# EAGLE design ATX Regulated Power Supply (EAGLE 5.11)
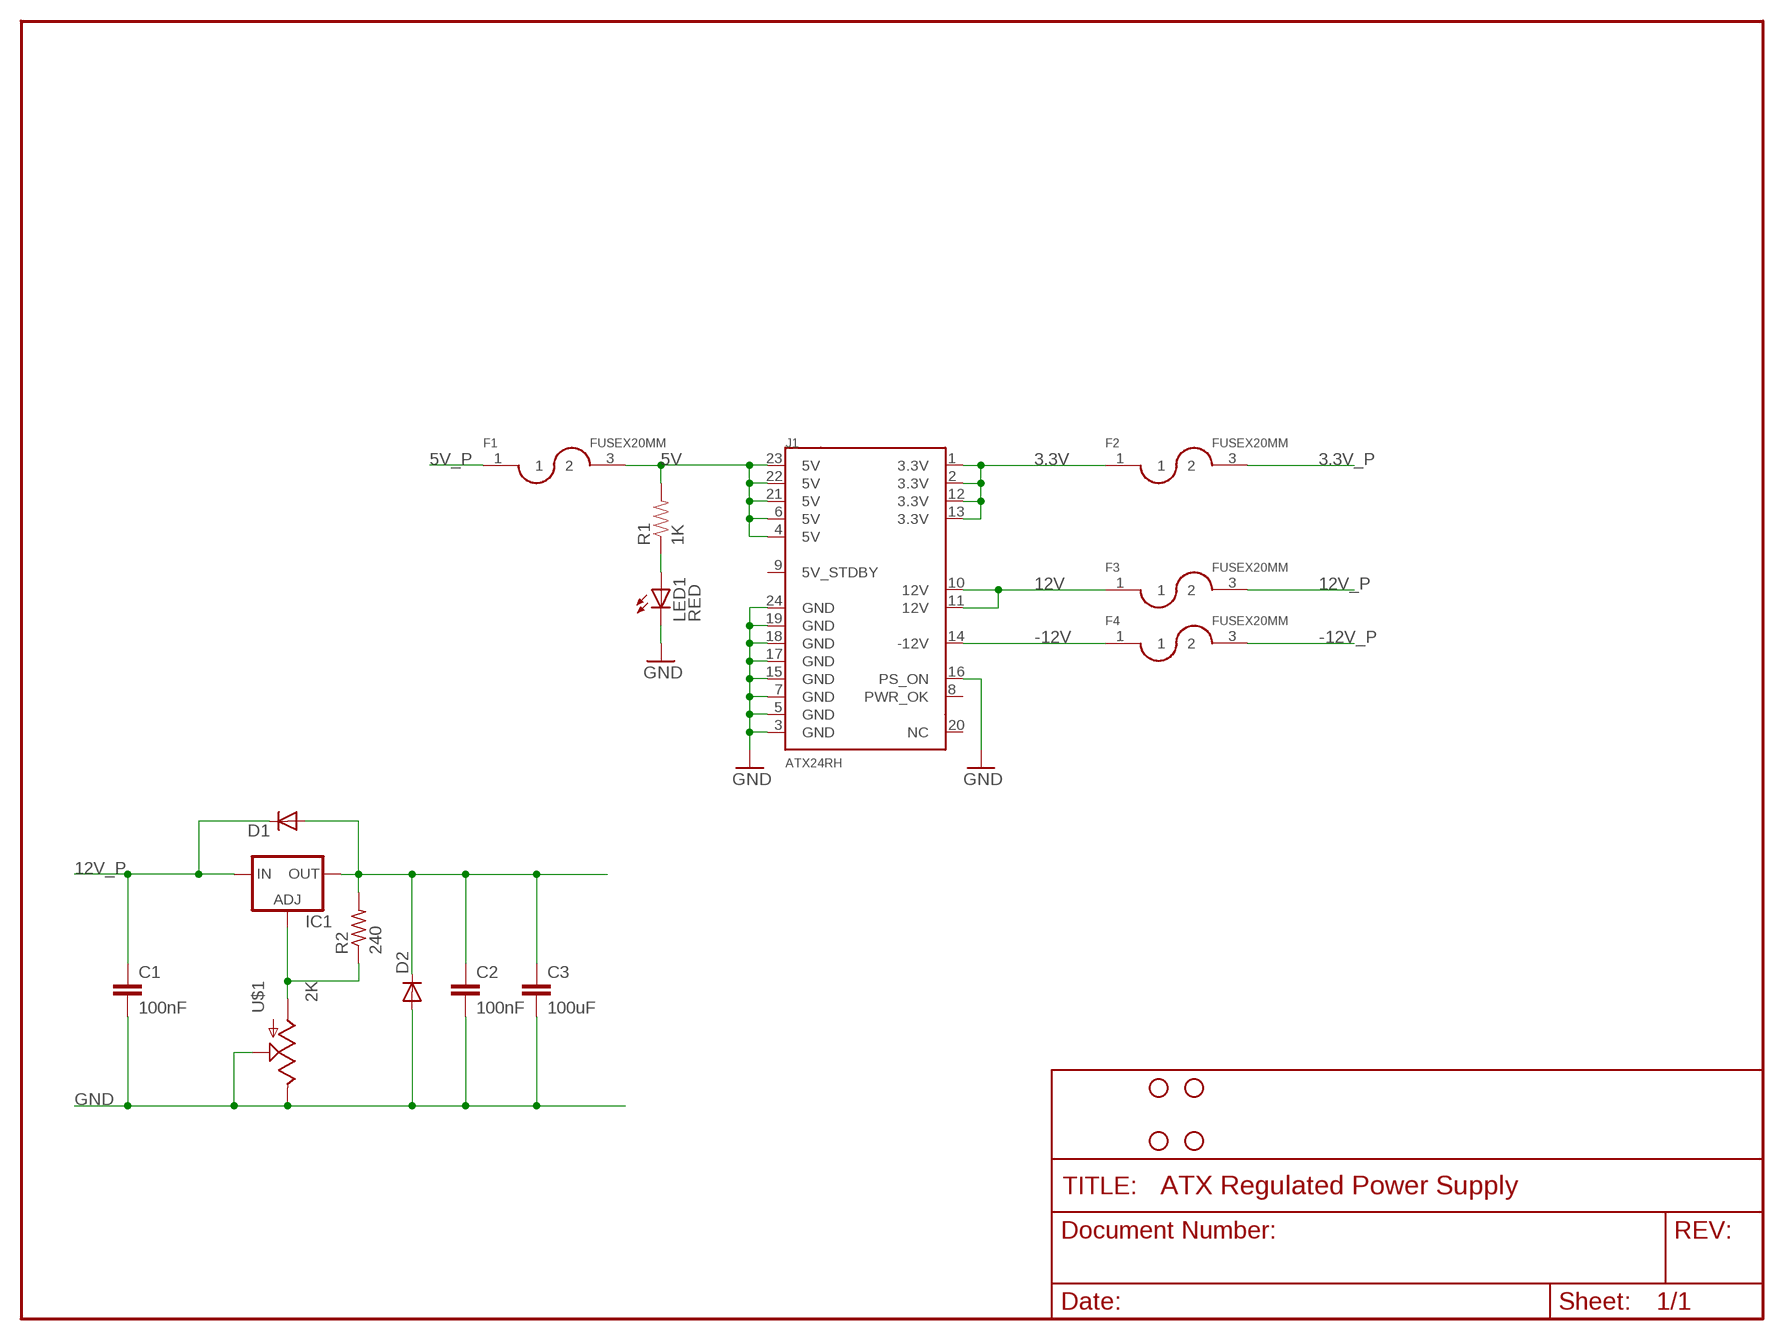
[diagram p0: schematic, sheet 1]

## Parts
C1  100nF  C-EU025-024X044  [C025-024X044]
C2  100nF  C-EU025-024X044  [C025-024X044]
C3  100uF  C-EU025-024X044  [C025-024X044]
D1  DIODE1N4148  [DIODE-1N4148]
D2  DIODE1N4148  [DIODE-1N4148]
F1  FUSEX20MM  [FUSE_5MM]
F2  FUSEX20MM  [FUSE_5MM]
F3  FUSEX20MM  [FUSE_5MM]
F4  FUSEX20MM  [FUSE_5MM]
IC1  LM317TS  [317TS]
J1  ATX24RH  [ATX24_RIGHT_ANGLE]
JP2  STAND-OFF  [STAND-OFF]
JP3  STAND-OFF  [STAND-OFF]
JP4  STAND-OFF  [STAND-OFF]
JP5  STAND-OFF  [STAND-OFF]
LED1  RED  LED5MM  [LED5MM]
R1  1K  RESISTORPTH1  [AXIAL-0.3]
R2  240  R-US_0204/2V  [0204V]
U$1  2K  POT-RV16AF-20  [POT_ALPHA_RV16AF-20]

## Nets
3.3V: F2.1 J1.1(3.3V) J1.2(3.3V) J1.12(3.3V) J1.13(3.3V)
3.3V_P: F2.3
5V: F1.3 J1.4(5V) J1.6(5V) J1.21(5V) J1.22(5V) J1.23(5V) R1.P$2
5V_P: F1.1
12V: F3.1 J1.10(12V) J1.11(12V)
12V_P: C1.1 D1.C F3.3 IC1.3(IN)
-12V: F4.1 J1.14(-12V)
-12V_P: F4.3
GND: C1.2 C2.2 C3.2 D2.A J1.3(GND) J1.5(GND) J1.7(GND) J1.15(GND) J1.16(PS_ON) J1.17(GND) J1.18(GND) J1.19(GND) J1.24(GND) LED1.K(C) U$1.2(S) U$1.3(E)
N$1: LED1.A R1.P$1
N$4: IC1.1(ADJ) R2.1 U$1.1(A)
VOUT: C2.1 C3.1 D1.A D2.C IC1.2(OUT) R2.2
Unconnected: J1.8(PWR_OK) J1.9(5V_STDBY) J1.20(NC)

## Library data of the parts
C1-C3 = resistor:C-EU: CAPACITOR, European symbol
D1 D2 = SparkFun:DIODE: Diode These are standard reverse protection diodes and small signal diodes. SMA package can handle up to about 1A. SOD-323 can handle about 200mA. What the SOD-323 package when ordering, there are some mfgs out there that are 5-pin packages.
F1-F4 = SparkFun:FUSE
IC1 = v-reg:LM317TS: VOLTAGE REGULATOR
J1 = SparkFun:ATX24
JP2-JP5 = SparkFun:STAND-OFF: Stand Off This is the mechanical footprint for a #4 phillips button head screw. Use the keepout ring to avoid running the screw head into surrounding components. SKU : PRT-00447
LED1 = SparkFun:LED: LEDs Standard schematic elements and footprints for 5mm, 3mm, 1206, and 0603 sized LEDs. 5mm - Spark Fun Electronics SKU : COM-00529 (and others)
R1 = SparkFun:RESISTOR: Resistor Basic schematic elements and footprints for 0603, 1206, and PTH 1/10th watt (small) resistors.
R2 = resistor:R-US_: RESISTOR, American symbol
U$1 = SparkFun:POT

## Board
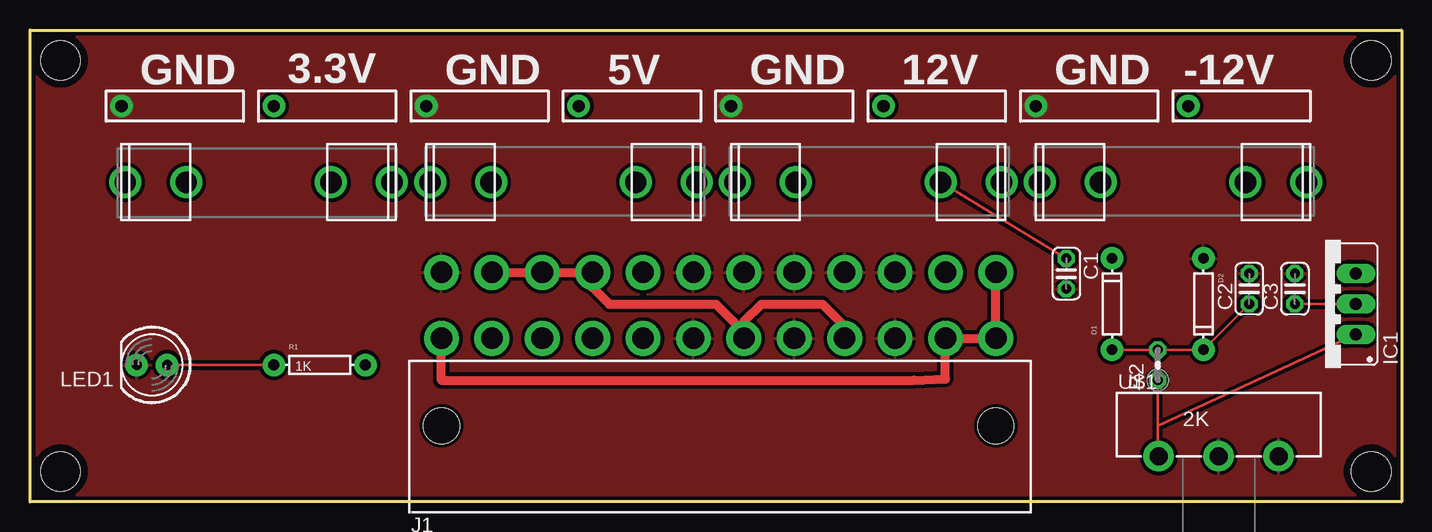
[diagram p1: board, top side]
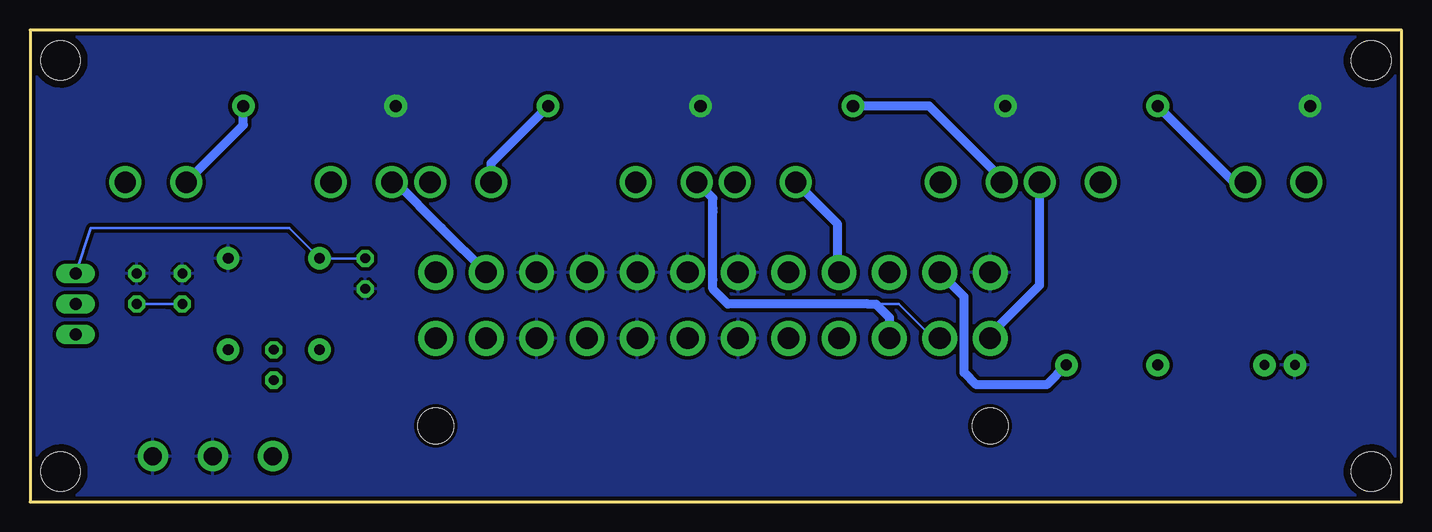
[diagram p2: board, bottom side, seen from below]

Size 114.3 x 39.37 mm. Coordinates in mm from the lower left corner, seen from the top.
Outline: 0,0 0,39.37 114.3,39.37 114.3,0 0,0
Copper layers (1*16): Top 0.035mm / dielectric 1.5mm / Bottom 0.035mm
Design rules "SparkFun": minimum track width 8mil, minimum drill 20mil, track to track 8mil, track to pad 8mil, pad to pad 8mil, via to via 8mil, smd to smd 8mil, copper to edge 8mil, drill to drill 8mil, minimum pad ring 12mil, minimum via ring 10mil, stop-mask expansion 4mil, vias tented up to drill 20mil, thermal gap 10mil

### Footprints (pad centres in the part's own frame; a part is rotated, then mirrored left to right if it is on the bottom)
C025-024X044 = drill 0.813 octagon: 1 -1.27,0; 2 1.27,0
DIODE-1N4148 = drill 0.9 pad 1.88 round: A -3.81,0; C 3.81,0
FUSE_5MM = drill 1.778 round: 1 0,-11.113; 2 0,-6.032; 3 0,6.032; 4 0,11.113
317TS = drill 1.016 long: 1 -2.54,-2.54; 2 0,-2.54; 3 2.54,-2.54
ATX24_RIGHT_ANGLE = drill 1.8 pad 2.9 round: 1 23.34,4.76; 2 19.14,4.76; 3 14.94,4.76; 4 10.74,4.76; 5 6.54,4.76; 6 2.34,4.76; 7 -1.86,4.76; 8 -6.06,4.76; 9 -10.26,4.76; 10 -14.46,4.76; 11 -18.66,4.76; 12 -22.86,4.76; 13 23.34,10.26; 14 19.14,10.26; 15 14.94,10.26; 16 10.74,10.26; 17 6.54,10.26; 18 2.34,10.26; 19 -1.86,10.26; 20 -6.06,10.26; 21 -10.26,10.26; 22 -14.46,10.26; 23 -18.66,10.26; 24 -22.86,10.26 | hole 3: -22.86,-2.54; 23.34,-2.54
STAND-OFF = hole 3.302: 0,0
LED5MM = drill 0.813 pad 1.88 round: A -1.27,0; K 1.27,0
AXIAL-0.3 = drill 0.9 pad 1.88 round: P$1 -3.81,0; P$2 3.81,0
0204V = drill 0.813 octagon: 1 -1.27,0; 2 1.27,0
POT_ALPHA_RV16AF-20 = drill 1.5 pad 2.54 round: 1 -5,0; 2 0,0; 3 5,0

### Placement (x,y rotation side)
C1  86.36,19.05 270 top
C2  101.6,17.78 90 top
C3  105.41,17.78 90 top
D1  90.17,16.51 90 top
D2  97.79,16.51 270 top
F1  44.45,26.67 270 top
F2  19.05,26.67 90 top
F3  69.85,26.67 270 top
F4  95.25,26.67 270 top
IC1  107.95,16.51 90 top
J1  57.15,8.89 0 top
JP2  111.76,2.54 0 top
JP3  111.76,36.83 0 top
JP4  2.54,2.54 0 top
JP5  2.54,36.83 0 top
LED1  10.16,11.43 180 top
R1  24.13,11.43 0 top
R2  93.98,11.43 90 top
U$1  99.06,3.81 0 top

### Tracks (layer width: path | path; a pad name or v marks a point on that pad's centre or on a via)
3.3V
  Top 0.762: 80.52,13.59 80.49,13.62 | 80.49,13.62 J1.1 | 80.49,13.62 J1.1 | J1.1 J1.13 | 80.52,13.59 80.49,13.62 | 80.52,13.59 80.49,13.62 | 80.49,13.62 J1.1 | 80.52,13.59 80.46,13.65 J1.2 76.29,10.25 73.66,10.16 34.29,10.16 J1.12
  Bottom 0.762: J1.12 34.29,13.97 30.16,18.1 F2.1
3.3V_P  (via drill 1.02 pad 1.88)
  Bottom 0.762: F2.3 13.97,26.67 v20.32,33.02
5V
  Top 0.762: 42.77,19.15 42.8,19.18 42.77,19.15 | J1.22 42.77,19.15 | J1.23 J1.22 | J1.22 42.77,19.15 | J1.22 43.03,19.15 43.05,19.18 43.08,19.15 J1.21 46.89,17.88 48.26,16.51 57.15,16.51 58.42,15.24 59.49,14.17 J1.6 59.49,15.04 60.96,16.51 66.04,16.51 67.89,14.66 J1.4
  Bottom 0.762: J1.23 36.45,17.11 36.45,13.08 36.45,10.79 35.43,9.78 29.59,9.78 R1.P$2 | J1.21 46.99,19.05 46.99,23.18 F1.3
5V_P  (via drill 1.02 pad 1.88)
  Bottom 0.762: v45.72,33.02 39.37,33.02 33.34,26.99 F1.1
12V
  Top 0.762: 42.73,13.65 42.8,13.72 42.73,13.65 | J1.10 42.73,13.65
  Bottom 0.203: 44.45,16.51 41.91,16.51 39.37,13.97 J1.11
  Bottom 0.762: J1.10 42.69,15.38 42.8,15.49 43.81,16.51 44.45,16.51 56.13,16.51 57.4,17.78 57.4,18.54 57.4,24.22 57.4,24.51 57.4,25.34 F3.1
12V_P  (via drill 1.02 pad 1.88)
  Top 0.203: F3.3 C1.1
  Bottom 0.203: IC1.3 109.22,22.86 92.71,22.86 D1.C 88.9,20.32 C1.1
  Bottom 0.762: F3.3 75.88,28.26 v71.12,33.02
-12V
  Bottom 0.762: J1.14 80.01,22.86 83.82,26.67 F4.1
-12V_P  (via drill 1.02 pad 1.88)
  Bottom 0.762: F4.3 96.52,31.43 v96.52,33.02
GND  (via drill 1.02 pad 1.88)
  other vias: 7.62,33.02 33.02,33.02 58.42,33.02 83.82,33.02
  pour Bottom (isolate 0.305): 0,0 0,39.37 114.3,39.37 114.3,0
  pour Top (isolate 0.305): 0,0 0,39.37 114.3,39.37 114.3,0
N$1
  Top 0.203: LED1.A R1.P$1
N$4
  Top 0.203: 93.98,6.35 R2.1 | 93.98,6.35 93.98,5.08 93.98,3.81 U$1.1 | 93.98,6.35 IC1.1
VOUT
  Top 0.203: D1.A R2.2 D2.C C2.1 | C3.1 IC1.2
  Bottom 0.203: C2.1 102.87,16.51 C3.1

### Text on the board
tPlace: GND | 3.3V | GND | 5V | GND | 12V | GND | -12V